# Altium project NanoBoardTesterAccessories.PrjPCB
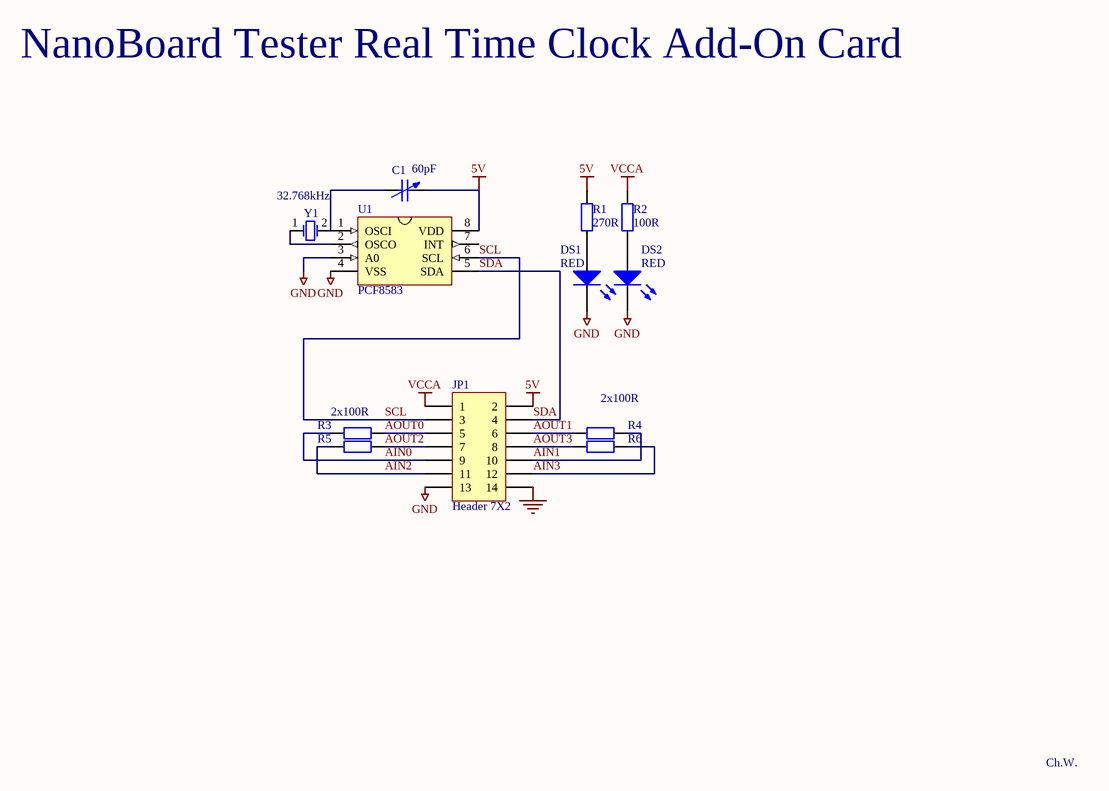
[diagram p0: NBT_RTC_ADDON.SchDoc]
2 sheets, 14 parts. Net scope: global (net labels, ports and power ports of the same name join across sheets).
Sheets:
  NBT_RTC_ADDON.SchDoc
  NBT_JTAG_LOOP_CABLE.SCHDOC

## Sheet NBT_RTC_ADDON.SchDoc
size A4; Organization: Altium Limited; Address1: L3, 12a Rodborough Rd; Address2: Frenchs Forest; Address3: NSW; Address4: Australia 2086; DocumentNumber: 1; SheetNumber: 1; SheetTotal: 3

### Parts
C1  value 60pF  [C3225-1210]  (hidden comment: Cap Var)
DS1  LED2  [DSO-F2/D6.1]  (value not drawn)
DS2  LED2  [DSO-F2/D6.1]  (value not drawn)
JP1  Header 7X2  [HDR2X7]
R1  270R  [AXIAL-0.4]
R2  value 100R  [AXIAL-0.4]  (hidden comment: Generic Components)
R3  Res2  [AXIAL-0.4]  (value not drawn)
R4  Res2  [AXIAL-0.4]  (value not drawn)
R5  Res2  [AXIAL-0.4]  (value not drawn)
R6  Res2  [AXIAL-0.4]  (value not drawn)
U1  PCF8583  [DIP-8]
Y1  32.768kHz  [BCY-W2/D3.1]

### Nets
5V: C1.2 JP1.2 R1.2 U1.8(VDD)
GND: DS1.2(K) DS2.2(K) JP1.13 JP1.14 U1.3(A0) U1.4(VSS)
VCCA: JP1.1 R2.2
AIN0: JP1.9 R3.2
AIN1: JP1.10 R4.1
AIN2: JP1.11 R5.2
AIN3: JP1.12 R6.1
AOUT0: JP1.5 R3.1
AOUT1: JP1.6 R4.2
AOUT2: JP1.7 R5.1
AOUT3: JP1.8 R6.2
SCL: JP1.3 U1.6(SCL)
SDA: JP1.4 U1.5(SDA)
NetC1_1: C1.1 U1.1(OSCI) Y1.2(OSC2)
NetDS1_1: DS1.1(A) R1.1
NetDS2_1: DS2.1(A) R2.1
NetU1_2: U1.2(OSCO) Y1.1(OSC1)

Not connected (* = marked no-connect by the designer): U1 7(INT)

### Notes on the sheet
- NanoBoard Tester Real Time Clock Add-On Card
- (near R3) 2x100R
- 2x100R
- Ch.W.
- Title
- Size:
- Date:
- A4
- Number:
- Time:
- Revision:
- Sheet
- of
- File:
- (in symbol LED2) RED

### Library data of the parts
C1 = Cap Var: Variable or Adjustable Capacitor; Manufacturer: Generic Components; Class I: Passive; Published: 24-Mar-1999; Revision: July-2002: Re-released for DXP Platform.; Publisher: Altium Limited; Class II: Capacitor
DS1 DS2 = LED2: Typical RED, GREEN, YELLOW, AMBER GaAs LED; Manufacturer: Generic Components; Class I: Optoelectronic; Published: 8-Jun-2000; Revision: July-2002: Re-released for DXP Platform.; Publisher: Altium Limited; Class II: LED
JP1 = Header 7X2: Header, 7-Pin, Dual row; Manufacturer: Generic Components; Class I: Connector; Revision: July-2002: Re-released for DXP Platform.; Publisher: Altium Limited
R1 = Res2: Resistor; Manufacturer: Generic Components; Class I: Passive; Published: 8-Jun-2000; Revision: July-2002: Re-released for DXP Platform.; Publisher: Altium Limited; Class II: Resistor; Value: 270R
R2 = Res2: Resistor; Class I: Passive; Published: 8-Jun-2000; Revision: July-2002: Re-released for DXP Platform.; Publisher: Altium Limited; Manufacturer: Generic Components; Class II: Resistor
R3-R6 = Res2: Resistor; Manufacturer: Generic Components; Class I: Passive; Value: 100R; Published: 8-Jun-2000; Revision: July-2002: Re-released for DXP Platform.; Publisher: Altium Limited; Class II: Resistor
U1 = PCF8583: Clock/Calendar with 240 x 8-bit RAM
Y1 = XTAL: Crystal Oscillator; Manufacturer: Generic Components; Published: 8-Jun-2000; Revision: July-2002: Re-released for DXP Platform.; Publisher: Altium Limited; Class I: Oscillator; Class II: Crystal Oscillator

## Sheet NBT_JTAG_LOOP_CABLE.SCHDOC
size A4; Organization: Altium Limited; Address1: L3, 12a Rodborough Rd; Address2: Frenchs Forest; Address3: NSW; Address4: Australia 2086; DocumentNumber: 3; SheetNumber: 3; SheetTotal: 3
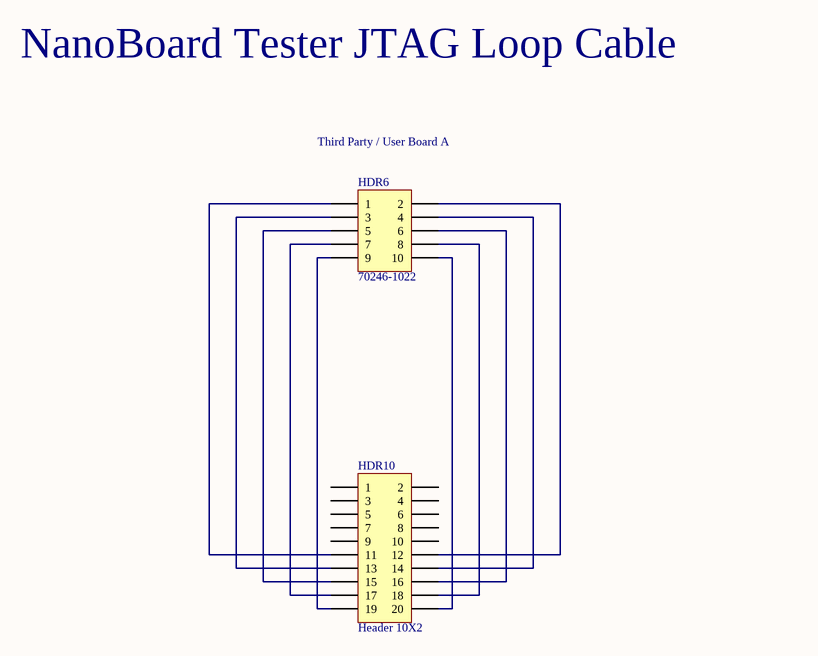
[diagram p1: NBT_JTAG_LOOP_CABLE.SCHDOC]

### Parts
HDR6  70246-1022  Usage: Third Party / User Board A  [HDR2X5_LP]
HDR10  Header 10X2  [HDR2X10]

### Nets
NetHDR6_1: HDR6.1 HDR10.11
NetHDR6_2: HDR6.2 HDR10.12
NetHDR6_3: HDR6.3 HDR10.13
NetHDR6_4: HDR6.4 HDR10.14
NetHDR6_5: HDR6.5 HDR10.15
NetHDR6_6: HDR6.6 HDR10.16
NetHDR6_7: HDR6.7 HDR10.17
NetHDR6_8: HDR6.8 HDR10.18
NetHDR6_9: HDR6.9 HDR10.19
NetHDR6_10: HDR6.10 HDR10.20

Not connected (* = marked no-connect by the designer): HDR10 1 2 3 4 5 6 7 8 9 10

### Notes on the sheet
- NanoBoard Tester JTAG Loop Cable
- Title
- Size:
- Date:
- A4
- Number:
- Time:
- Revision:
- Sheet
- of
- File:

### Library data of the parts
HDR6 = Header 5X2: Header, 5-Pin, Dual row; Manufacturer: Molex; Class I: Connector; Fitted: True; Revision: July-2002: Re-released for DXP Platform.; Publisher: Altium Limited
HDR10 = Header 10X2: Header, 10-Pin, Dual row; Manufacturer: Generic Components; Class I: Connector; Fitted: True; Revision: July-2002: Re-released for DXP Platform.; Publisher: Altium Limited